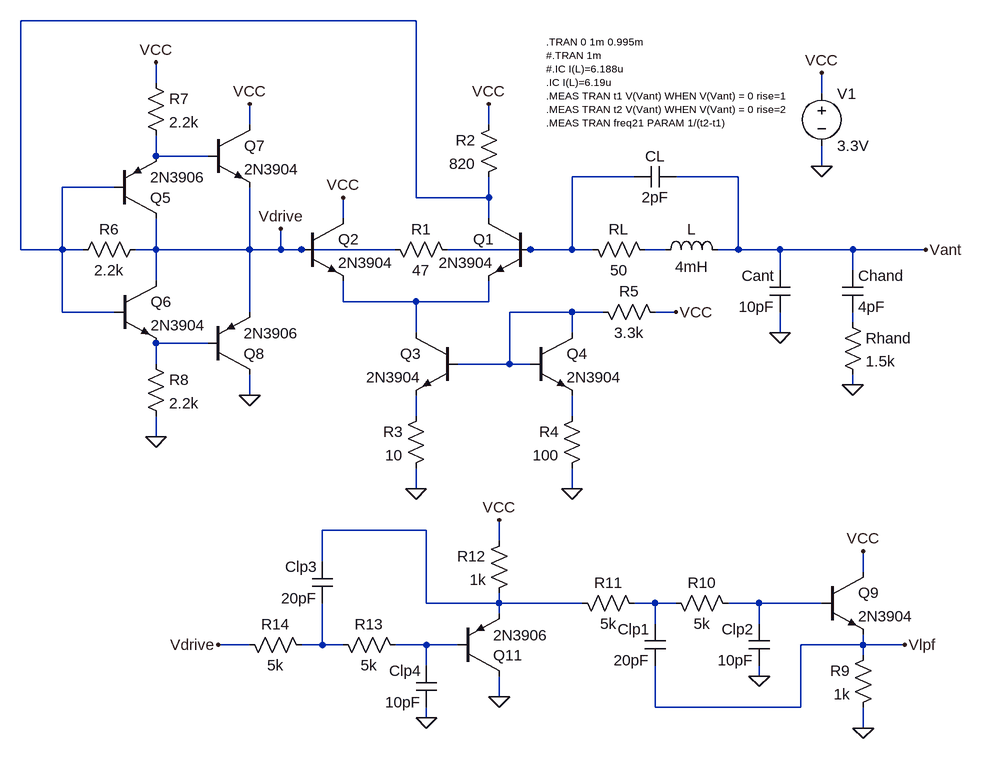
[diagram p0: schematic dewster_diff_osc_8xistor_2021-08-24.asc]
dewster_diff_osc_8xistor_2021-08-24.asc, the LTspice schematic file:
Version 4
SHEET 1 2908 1156
WIRE 272 48 -336 48
WIRE -128 144 -128 112
WIRE 896 160 896 128
WIRE 16 208 16 176
WIRE 384 208 384 176
WIRE -128 256 -128 224
WIRE -48 256 -128 256
WIRE 896 272 896 240
WIRE 608 288 512 288
WIRE 768 288 672 288
WIRE -192 304 -272 304
WIRE 272 320 272 48
WIRE 384 320 384 288
WIRE 384 320 272 320
WIRE 160 352 160 320
WIRE 384 352 384 320
WIRE -336 400 -336 48
WIRE -272 400 -272 304
WIRE -272 400 -336 400
WIRE -240 400 -272 400
WIRE -128 400 -128 352
WIRE -128 400 -160 400
WIRE 16 400 16 304
WIRE 16 400 -128 400
WIRE 64 400 64 368
WIRE 64 400 16 400
WIRE 96 400 64 400
WIRE 240 400 96 400
WIRE 448 400 320 400
WIRE 512 400 512 288
WIRE 512 400 448 400
WIRE 544 400 512 400
WIRE 656 400 624 400
WIRE 768 400 768 288
WIRE 768 400 736 400
WIRE 832 400 768 400
WIRE 944 400 832 400
WIRE 1056 400 944 400
WIRE 832 432 832 400
WIRE 944 432 944 400
WIRE -128 448 -128 400
WIRE 160 480 160 448
WIRE 272 480 160 480
WIRE 384 480 384 448
WIRE 384 480 272 480
WIRE -272 496 -272 400
WIRE -192 496 -272 496
WIRE 16 496 16 400
WIRE 512 496 416 496
WIRE 560 496 512 496
WIRE 672 496 640 496
WIRE 944 512 944 496
WIRE 272 528 272 480
WIRE 512 528 512 496
WIRE 832 528 832 496
WIRE -48 544 -128 544
WIRE -128 576 -128 544
WIRE 416 576 416 496
WIRE 416 576 336 576
WIRE 448 576 416 576
WIRE 944 608 944 592
WIRE 16 624 16 592
WIRE 272 656 272 624
WIRE 512 656 512 624
WIRE -128 688 -128 656
WIRE 272 768 272 736
WIRE 512 768 512 736
WIRE 288 832 128 832
WIRE 400 848 400 816
WIRE 128 880 128 832
WIRE 960 896 960 864
WIRE 288 944 288 832
WIRE 400 944 400 928
WIRE 400 944 288 944
WIRE 528 944 400 944
WIRE 640 944 608 944
WIRE 672 944 640 944
WIRE 800 944 752 944
WIRE 896 944 800 944
WIRE 400 960 400 944
WIRE 640 976 640 944
WIRE 800 976 800 944
WIRE 16 1008 -32 1008
WIRE 128 1008 128 944
WIRE 128 1008 96 1008
WIRE 160 1008 128 1008
WIRE 288 1008 240 1008
WIRE 336 1008 288 1008
WIRE 960 1008 960 992
WIRE 960 1008 864 1008
WIRE 1024 1008 960 1008
WIRE 960 1024 960 1008
WIRE 288 1040 288 1008
WIRE 800 1056 800 1040
WIRE 400 1088 400 1056
WIRE 640 1104 640 1040
WIRE 864 1104 864 1008
WIRE 864 1104 640 1104
WIRE 288 1120 288 1104
WIRE 960 1136 960 1104
FLAG 896 272 0
FLAG 896 128 VCC
FLAG 1056 400 Vant
FLAG 832 528 0
FLAG 672 496 VCC
FLAG 512 768 0
FLAG 272 768 0
FLAG 384 176 VCC
FLAG 64 368 Vdrive
FLAG 16 624 0
FLAG 16 176 VCC
FLAG -128 112 VCC
FLAG -128 688 0
FLAG 160 320 VCC
FLAG 944 608 0
FLAG 960 864 VCC
FLAG 960 1136 0
FLAG 800 1056 0
FLAG 400 816 VCC
FLAG 400 1088 0
FLAG 288 1120 0
FLAG -32 1008 Vdrive
FLAG 1024 1008 Vlpf
SYMBOL res 336 416 M270
WINDOW 0 32 56 VTop 2
WINDOW 3 0 56 VBottom 2
SYMATTR InstName R1
SYMATTR Value 47
SYMBOL voltage 896 144 R0
WINDOW 123 0 0 Left 2
WINDOW 39 0 0 Left 2
SYMATTR InstName V1
SYMATTR Value 3.3V
SYMBOL npn 96 352 R0
SYMATTR InstName Q2
SYMATTR Value 2N3904
SYMBOL ind 640 416 R270
WINDOW 0 32 56 VTop 2
WINDOW 3 5 56 VBottom 2
SYMATTR InstName L
SYMATTR Value 4mH
SYMBOL cap 848 432 M0
SYMATTR InstName Cant
SYMATTR Value 10pF
SYMBOL npn 448 352 M0
SYMATTR InstName Q1
SYMATTR Value 2N3904
SYMBOL res 400 192 M0
SYMATTR InstName R2
SYMATTR Value 820
SYMBOL res 656 512 M270
WINDOW 0 32 56 VTop 2
WINDOW 3 0 56 VBottom 2
SYMATTR InstName R5
SYMATTR Value 3.3k
SYMBOL npn 448 528 R0
SYMATTR InstName Q4
SYMATTR Value 2N3904
SYMBOL res 528 640 M0
SYMATTR InstName R4
SYMATTR Value 100
SYMBOL npn 336 528 M0
SYMATTR InstName Q3
SYMATTR Value 2N3904
SYMBOL res 288 640 M0
SYMATTR InstName R3
SYMATTR Value 10
SYMBOL res 640 416 M270
WINDOW 0 32 56 VTop 2
WINDOW 3 0 56 VBottom 2
SYMATTR InstName RL
SYMATTR Value 50
SYMBOL cap 672 272 R90
WINDOW 0 0 32 VBottom 2
WINDOW 3 32 32 VTop 2
SYMATTR InstName CL
SYMATTR Value 2pF
SYMBOL npn -48 208 R0
SYMATTR InstName Q7
SYMATTR Value 2N3904
SYMBOL pnp -48 592 M180
WINDOW 0 55 32 Left 2
WINDOW 3 55 63 Left 2
SYMATTR InstName Q8
SYMATTR Value 2N3906
SYMBOL pnp -192 352 M180
WINDOW 0 55 32 Left 2
WINDOW 3 55 63 Left 2
SYMATTR InstName Q5
SYMATTR Value 2N3906
SYMBOL npn -192 448 R0
SYMATTR InstName Q6
SYMATTR Value 2N3904
SYMBOL res -144 128 R0
SYMATTR InstName R7
SYMATTR Value 2.2k
SYMBOL res -144 560 R0
SYMATTR InstName R8
SYMATTR Value 2.2k
SYMBOL res -144 384 R90
WINDOW 0 0 56 VBottom 2
WINDOW 3 32 56 VTop 2
SYMATTR InstName R6
SYMATTR Value 2.2k
SYMBOL cap 928 432 R0
SYMATTR InstName Chand
SYMATTR Value 4pF
SYMBOL res 928 496 R0
SYMATTR InstName Rhand
SYMATTR Value 1.5k
SYMBOL npn 896 896 R0
SYMATTR InstName Q9
SYMATTR Value 2N3904
SYMBOL res 976 1008 M0
SYMATTR InstName R9
SYMATTR Value 1k
SYMBOL res 768 960 M270
WINDOW 0 32 56 VTop 2
WINDOW 3 0 56 VBottom 2
SYMATTR InstName R10
SYMATTR Value 5k
SYMBOL res 624 960 M270
WINDOW 0 32 56 VTop 2
WINDOW 3 0 56 VBottom 2
SYMATTR InstName R11
SYMATTR Value 5k
SYMBOL cap 656 976 M0
SYMATTR InstName Clp1
SYMATTR Value 20pF
SYMBOL cap 816 976 M0
SYMATTR InstName Clp2
SYMATTR Value 10pF
SYMBOL pnp 336 1056 M180
WINDOW 0 55 32 Left 2
WINDOW 3 55 63 Left 2
SYMATTR InstName Q11
SYMATTR Value 2N3906
SYMBOL res 416 832 M0
SYMATTR InstName R12
SYMATTR Value 1k
SYMBOL res 256 1024 M270
WINDOW 0 32 56 VTop 2
WINDOW 3 0 56 VBottom 2
SYMATTR InstName R13
SYMATTR Value 5k
SYMBOL res 112 1024 M270
WINDOW 0 32 56 VTop 2
WINDOW 3 0 56 VBottom 2
SYMATTR InstName R14
SYMATTR Value 5k
SYMBOL cap 144 880 M0
SYMATTR InstName Clp3
SYMATTR Value 20pF
SYMBOL cap 304 1040 M0
SYMATTR InstName Clp4
SYMATTR Value 10pF
TEXT 472 80 Left 1 !.TRAN 0 1m 0.995m\n#.TRAN 1m\n#.IC I(L)=6.188u\n.IC I(L)=6.19u\n.MEAS TRAN t1 V(Vant) WHEN V(Vant) = 0 rise=1\n.MEAS TRAN t2 V(Vant) WHEN V(Vant) = 0 rise=2\n.MEAS TRAN freq21 PARAM 1/(t2-t1)

The netlist it stands for:
* dewster_diff_osc_8xistor_2021-08-24.asc
R1 N003 Vdrive 47
V1 VCC 0 3.3V
Q2 VCC Vdrive N005 0 2N3904
L N004 Vant 4mH
Cant Vant 0 10pF
Q1 N001 N003 N005 0 2N3904
R2 VCC N001 820
R5 VCC N006 3.3k
Q4 N006 N006 N010 0 2N3904
R4 N010 0 100
Q3 N005 N006 N009 0 2N3904
R3 N009 0 10
RL N004 N003 50
CL Vant N003 2pF
Q7 VCC N002 Vdrive 0 2N3904
Q8 0 N008 Vdrive 0 2N3906
Q5 Vdrive N001 N002 0 2N3906
Q6 Vdrive N001 N008 0 2N3904
R7 VCC N002 2.2k
R8 N008 0 2.2k
R6 Vdrive N001 2.2k
Chand Vant N007 4pF
Rhand N007 0 1.5k
Q9 VCC N013 Vlpf 0 2N3904
R9 Vlpf 0 1k
R10 N013 N012 5k
R11 N012 N011 5k
Clp1 N012 Vlpf 20pF
Clp2 N013 0 10pF
Q11 0 N015 N011 0 2N3906
R12 VCC N011 1k
R13 N015 N014 5k
R14 N014 Vdrive 5k
Clp3 N011 N014 20pF
Clp4 N015 0 10pF
.model NPN NPN
.model PNP PNP
.lib standard.bjt
.TRAN 0 1m 0.995m
#.TRAN 1m
#.IC I(L)=6.188u
.IC I(L)=6.19u
.MEAS TRAN t1 V(Vant) WHEN V(Vant) = 0 rise=1
.MEAS TRAN t2 V(Vant) WHEN V(Vant) = 0 rise=2
.MEAS TRAN freq21 PARAM 1/(t2-t1)
.backanno
.end